# EAGLE design badge_buttons (EAGLE 9.0.1)
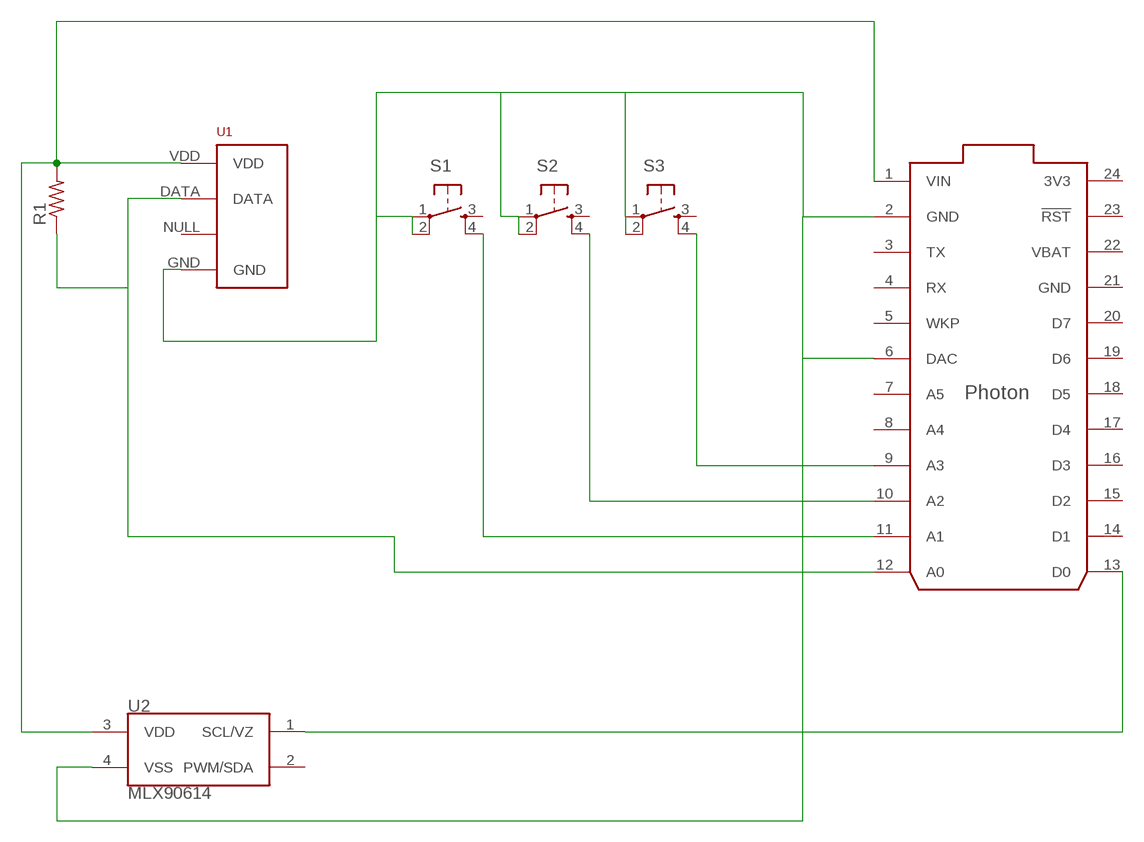
[diagram p0: schematic, sheet 1]

## Parts
R1  R-US_0204/7  [0204/7]
S1  TAC_SWITCHPTH  [TACTILE-PTH]
S2  TAC_SWITCHPTH  [TACTILE-PTH]
S3  TAC_SWITCHPTH  [TACTILE-PTH]
U1  RHT03_DHT-22_AM2302  [RHT03_DHT-22]
U2  MLX90614  [TO-39]
U$1  PHOTON_WITH_HEADERS  [PHOTON]

## Nets
N$1: S3.4 U$1.9(A3)
N$2: S2.4 U$1.10(A2)
N$3: S1.4 U$1.11(A1)
N$4: S1.1 S1.2 S2.1 S2.2 S3.1 S3.2 U1.GND U2.4(VSS) U$1.2(GND) U$1.6(DAC)
N$5: R1.2 U1.VDD U2.3(VDD) U$1.1(VIN)
N$6: R1.1 U1.DATA U$1.12(A0)
N$7: U2.1(SCL/VZ) U$1.13(D0)
Unconnected: S1.3 S2.3 S3.3 U1.NULL U2.2(PWM/SDA) U$1.3(TX) U$1.4(RX) U$1.5(WKP) U$1.7(A5) U$1.8(A4) U$1.14(D1) U$1.15(D2) U$1.16(D3) U$1.17(D4) U$1.18(D5) U$1.19(D6) U$1.20(D7) U$1.23(!RST)

## Power pins joined to a net without a drawn wire
3V3: U$1.24(3V3)
GND: U$1.21(GND)
VBAT: U$1.22(VBAT)

## Library data of the parts
R1 = resistor:R-US_: RESISTOR, American symbol
S1-S3 = SparkFun-Retired:TAC_SWITCH: Momentary Switch Button commonly used for reset or general input. Spark Fun Electronics SKU : COM-00097 SMT- SWCH-08247
U1 = RHT03_DHT-22_AM2302:RHT03_DHT-22_AM2302: RHT03 / DHT-22 / AM2302 Packages and symbol for the RHT03 / DHT-22 relative humidity and temperature sensor. Note: The AM2302 is a wired version of the DHT-22 which typically requires less clearance and is thus provided as a separate package.; PROD_ID: SEN-10167
U2 = SparkFun-Sensors:MLX90614: Melexis MLX90614 Infrared (IR) Thermometer The MLX90614 is a passive infrared (PIR) I2C temperature sensor.It is designed for non-contact temperature sensing. An internal 17-bit ADC and a powerful DSP contribute to the MLX90614’s high accuracy and resolution. It has a huge number of applications including body temperature measurment and movement detection. Datasheet <http://www.sparkfun.com/datasheets/Sensors/Temperature/SEN-09570-datasheet-3901090614M005.pdf> SparkFun Products Infrared Thermometer - MLX90614 <https://www.sparkfun.com/products/9570> (SEN-09570) SparkFun IR Thermometer Evaluation Board - MLX90614 <https://www.sparkfun.com/products/10740> (SEN-10740); PROD_ID: COMP-09719; SF_ID: SEN-09570
U$1 = Particle-Devices:PHOTON: Particle Photon Wi-Fi through-hole development board footprint Product datasheet: here <https://docs.particle.io/datasheets/photon-(wifi)/photon-datasheet/> Design files: here <https://github.com/particle-iot/photon> Github : Particle devices library <https://github.com/particle-iot/hardware-libraries/tree/master/Eagle>

## Board
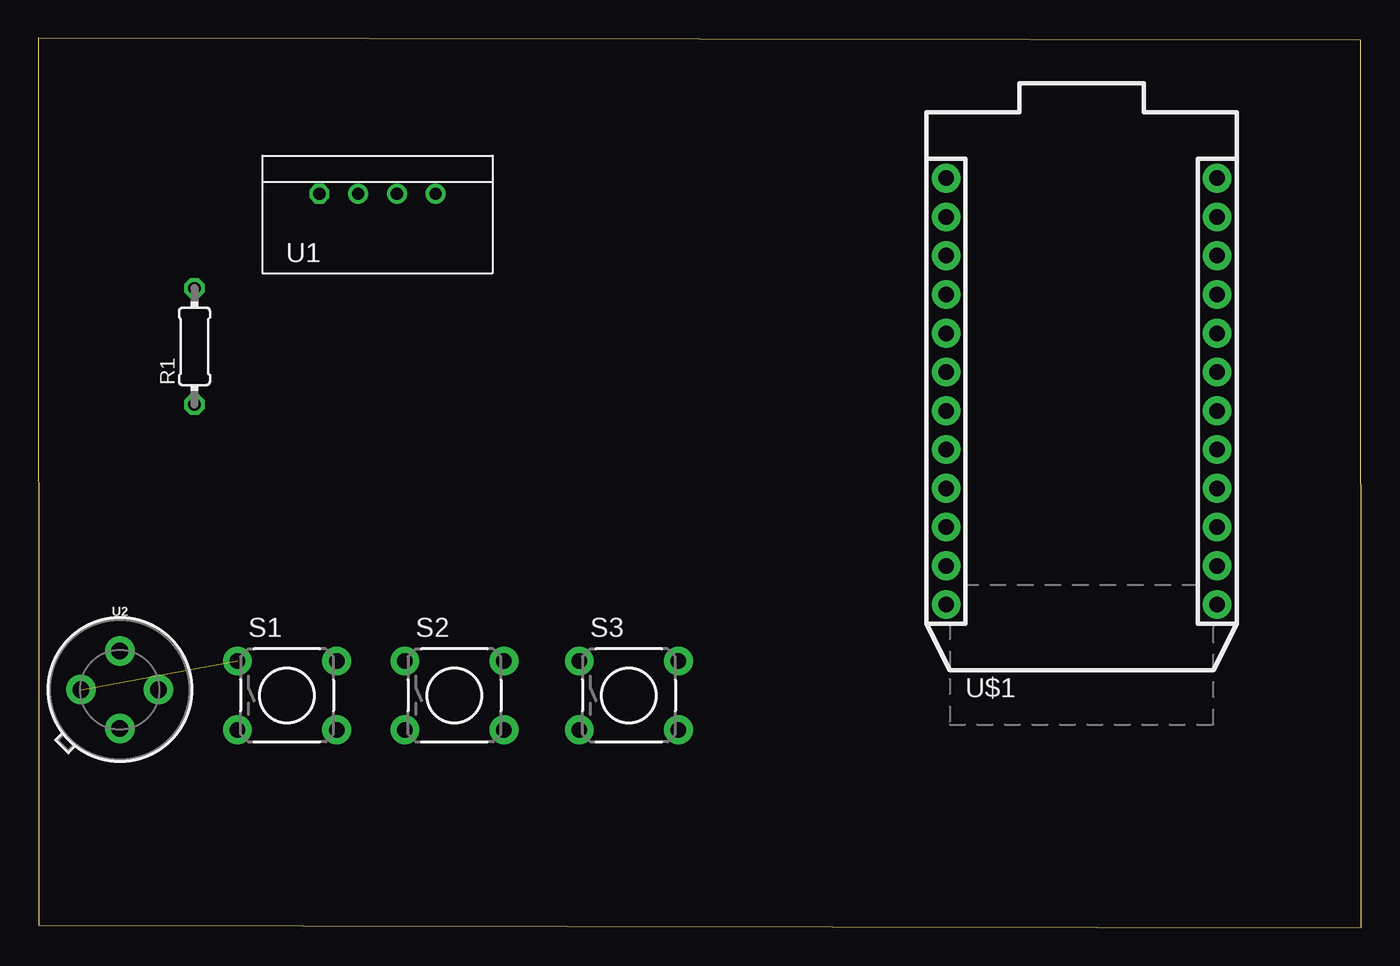
[diagram p1: board, top side]
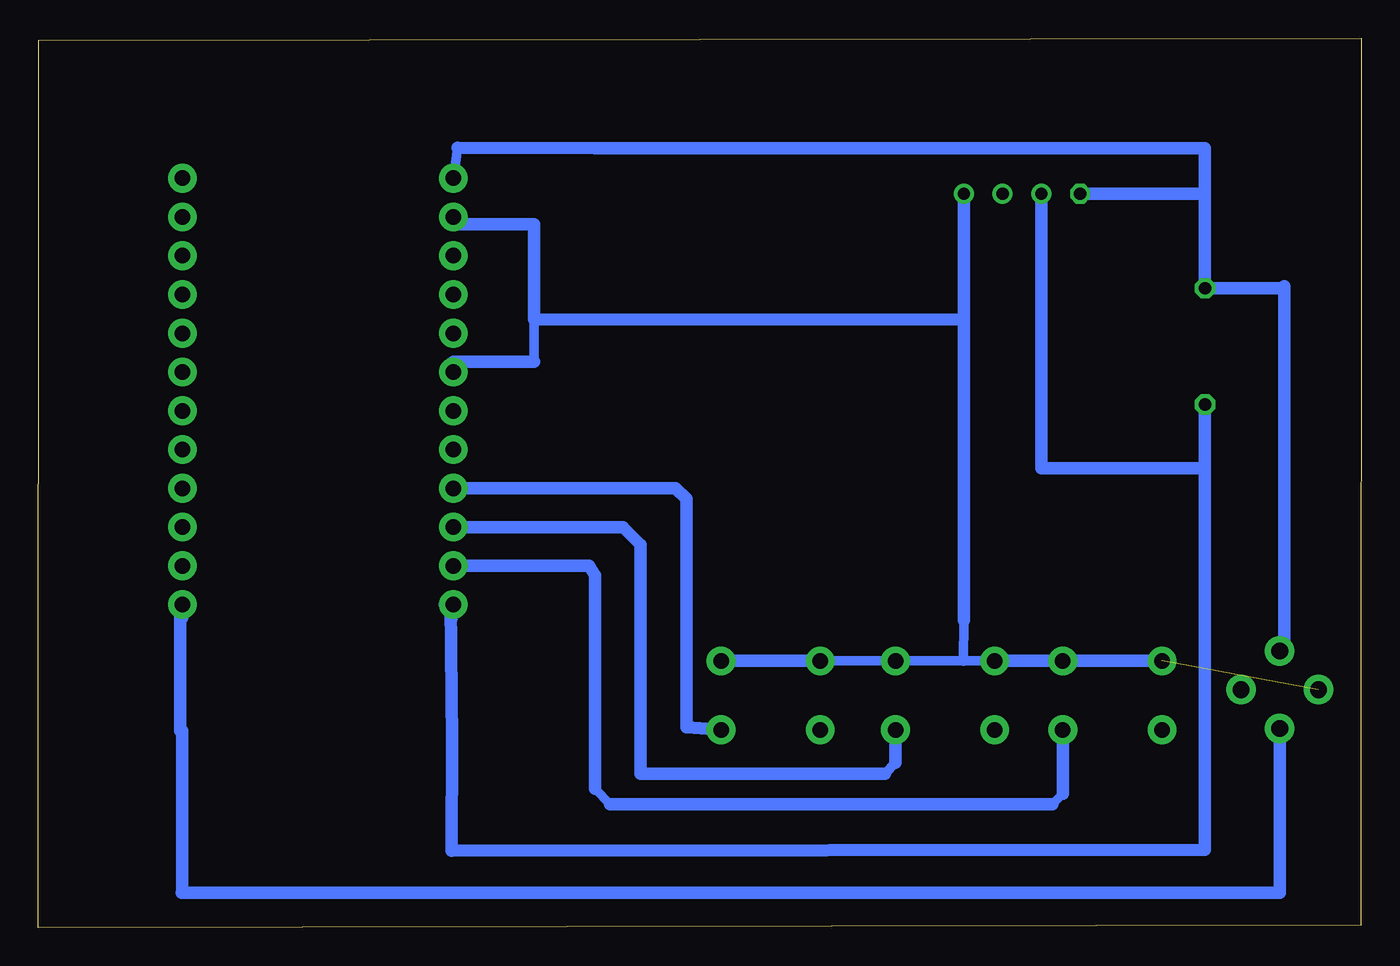
[diagram p2: board, bottom side, seen from below]

Size 86.75 x 58.3 mm. Coordinates in mm from the lower left corner, seen from the top.
Outline: 0.05,0.15 86.75,0 86.7,58.15 0,58.3 0.05,0.15
Copper layers (1*16): Top 0.035mm / dielectric 1.5mm / Bottom 0.035mm
Design rules "default": minimum track width 6mil, minimum drill 0.35mm, track to track 6mil, track to pad 6mil, pad to pad 6mil, via to via 6mil, smd to smd 6mil, copper to edge 40mil, drill to drill 6mil, minimum pad ring 10mil, minimum via ring 8mil, stop-mask expansion 4mil, vias tented up to drill 0mil, thermal gap 10mil

### Footprints (pad centres in the part's own frame; a part is rotated, then mirrored left to right if it is on the bottom)
0204/7 = drill 0.813 octagon: 1 -3.81,0; 2 3.81,0
TACTILE-PTH = drill 1.016 pad 1.88: 1 -3.251,2.261; 2 3.251,2.261; 3 -3.251,-2.261; 4 3.251,-2.261
RHT03_DHT-22 = drill 0.8: DATA -1.27,0; GND 3.81,0; NULL 1.27,0 | drill 0.8 octagon: VDD -3.81,0
TO-39 = drill 1.1 pad 1.93: 1 2.54,0; 2 0,2.54; 3 -2.54,0; 4 0,-2.54
PHOTON = drill 1.016 pad 1.88: 1 1.27,33.02; 2 1.27,30.48; 3 1.27,27.94; 4 1.27,25.4; 5 1.27,22.86; 6 1.27,20.32; 7 1.27,17.78; 8 1.27,15.24; 9 1.27,12.7; 10 1.27,10.16; 11 1.27,7.62; 12 1.27,5.08; 13 19.05,5.08; 14 19.05,7.62; 15 19.05,10.16; 16 19.05,12.7; 17 19.05,15.24; 18 19.05,17.78; 19 19.05,20.32; 20 19.05,22.86; 21 19.05,25.4; 22 19.05,27.94; 23 19.05,30.48; 24 19.05,33.02

### Placement (x,y rotation side)
R1  10.25,38.1 90 top
S1  16.32,15.23 0 top
S2  27.29,15.23 0 top
S3  38.73,15.23 0 top
U1  22.25,48.1 0 top
U2  5.35,15.6 270 top
U$1  58.25,16.1 0 top

### Tracks (layer width: path | path; a pad name or v marks a point on that pad's centre or on a via)
N$1
  Bottom 0.305: U$1.9 59.25,29.07 59.25,29.1
  Bottom 0.813: S3.4 44.25,13.14 44.25,28.1 44.95,28.8 U$1.9
N$2
  Bottom 0.61: 30.54,10.81 31.25,10.1
  Bottom 0.813: S2.4 30.54,10.81 | 31.25,10.1 47.25,10.1 47.25,25.1 48.41,26.26 U$1.10
N$3
  Bottom 0.61: 19.57,8.78 20.25,8.1 | 49.25,8.1 50.25,9.1
  Bottom 0.813: S1.4 19.57,8.78 | 20.25,8.1 49.25,8.1 | 50.25,9.1 50.25,23.1 50.63,23.72 U$1.11
N$4  (1 unrouted)
  Bottom 0.508: S2.1 24.25,17.49 | 30.65,17.4 30.64,17.49 | U$1.6 59.52,37.1
  Bottom 0.61: S3.1 30.64,17.49 S2.2 24.25,17.49 26.1,17.47 26.07,20.16 | 54.25,37.1 54.25,39.88 | U$1.2 59.52,46.1
  Bottom 0.813: S1.1 S1.2 S2.1 | S3.1 S3.2 | U1.GND 26.06,42.39 26.07,39.83 | 26.07,39.83 26.07,20.16 | 26.07,39.83 54.25,39.88 54.25,46.1 59.52,46.1 | 59.52,37.1 54.25,37.1
N$5
  Bottom 0.61: 59.25,51.12 U$1.1
  Bottom 0.813: U1.VDD 10.25,48.1 | 10.25,48.1 10.25,51.1 50.25,51.1 59.25,51.12 | 10.25,48.1 R1.2 5.05,41.91 | 5.05,41.91 5.05,42.05 | 5.05,41.91 5.05,18.14 U2.3
N$6
  Bottom 0.508: U$1.12 60.25,21.18 59.4,21.06 59.52,20.16 59.72,21.25
  Bottom 0.813: U1.DATA 20.98,30.1 10.25,30.1 | 10.25,30.1 10.25,5.1 59.65,5.05 59.6,12.25 59.72,21.25 | R1.1 10.25,30.1
N$7
  Bottom 0.813: U2.1 5.35,2.3 77.3,2.3 | 77.35,2.3 77.3,2.3 | 77.3,2.3 77.3,12.9 77.45,12.9 77.45,20.32 77.3,20.32 U$1.13